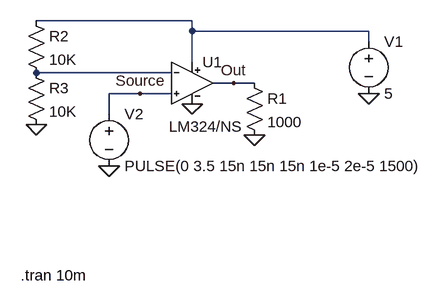
[diagram p0: schematic LM324-national_test.asc]
LM324-national_test.asc, the LTspice schematic file:
Version 4
SHEET 1 880 680
WIRE 96 112 -144 112
WIRE 96 128 96 112
WIRE 368 128 96 128
WIRE 368 144 368 128
WIRE 96 176 96 128
WIRE 64 192 -144 192
WIRE 160 208 128 208
WIRE 192 208 160 208
WIRE 16 224 -32 224
WIRE 64 224 16 224
WIRE -32 256 -32 224
FLAG 368 224 0
FLAG 96 240 0
FLAG -144 272 0
FLAG -32 336 0
FLAG 16 224 Source
FLAG 160 208 Out
FLAG 192 288 0
SYMBOL voltage 368 128 R0
WINDOW 123 0 0 Left 0
WINDOW 39 0 0 Left 0
SYMATTR InstName V1
SYMATTR Value 5
SYMBOL res -160 96 R0
SYMATTR InstName R2
SYMATTR Value 10K
SYMBOL res -160 176 R0
SYMATTR InstName R3
SYMATTR Value 10K
SYMBOL voltage -32 240 R0
WINDOW 123 0 0 Left 0
WINDOW 39 0 0 Left 0
SYMATTR InstName V2
SYMATTR Value PULSE(0 3.5 15n 15n 15n 1e-5 2e-5 1500)
SYMBOL res 176 192 R0
SYMATTR InstName R1
SYMATTR Value 1000
SYMBOL Opamps\\LM324-national 96 144 R0
WINDOW 3 -36 131 Left 0
SYMATTR InstName U1
TEXT -168 504 Left 0 !.tran 10m

The netlist it stands for:
* LM324-national_test.asc
V1 N001 0 5
R2 N001 N002 10K
R3 N002 0 10K
V2 Source 0 PULSE(0 3.5 15n 15n 15n 1e-5 2e-5 1500)
R1 Out 0 1000
XU1 Source N002 N001 0 Out LM324/NS  ; pins In+ In- V+ V- OUT
.tran 10m
.lib LM324.mod
.backanno
.end